# Altium schematic sheet Sheet1.SchDoc
size Letter
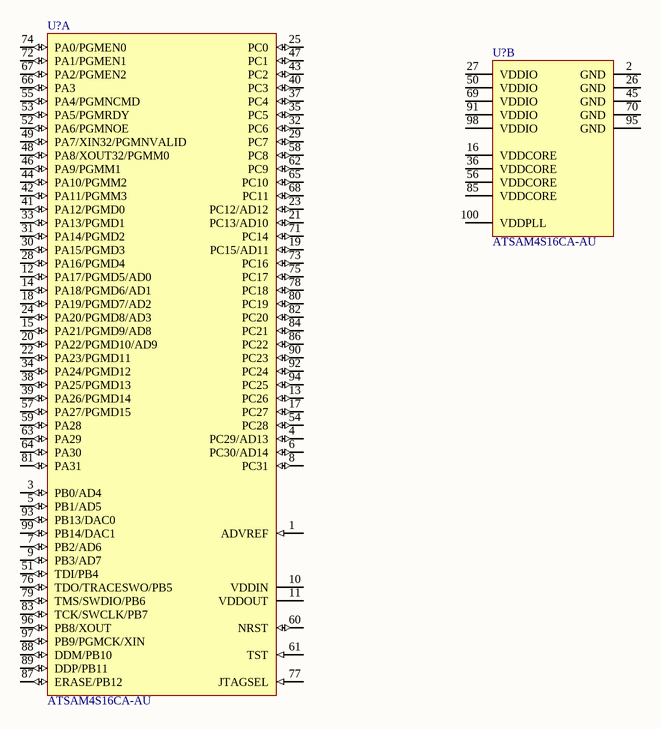
[diagram p0: Sheet1.SchDoc]

## Parts
(Parts that share a designator on the sheet are numbered #1, #2 ... from top to bottom, then left to right.)
U?#1  ATSAM4S16CA-AU  [LQFP100_N]  (part A of 2)
U?#2  ATSAM4S16CA-AU  [LQFP100_N]  (part B of 2)

## Nets

Not connected (* = marked no-connect by the designer): U?#1 1(ADVREF) 3(PB0/AD4) 4(PC29/AD13) 5(PB1/AD5) 6(PC30/AD14) 7(PB2/AD6) 8(PC31) 9(PB3/AD7) 10(VDDIN) 11(VDDOUT) 12(PA17/PGMD5/AD0) 13(PC26) 14(PA18/PGMD6/AD1) 15(PA21/PGMD9/AD8) 17(PC27) 18(PA19/PGMD7/AD2) 19(PC15/AD11) 20(PA22/PGMD10/AD9) 21(PC13/AD10) 22(PA23/PGMD11) 23(PC12/AD12) 24(PA20/PGMD8/AD3) 25(PC0) 28(PA16/PGMD4) 29(PC7) 30(PA15/PGMD3) 31(PA14/PGMD2) 32(PC6) 33(PA13/PGMD1) 34(PA24/PGMD12) 35(PC5) 37(PC4) 38(PA25/PGMD13) 39(PA26/PGMD14) 40(PC3) 41(PA12/PGMD0) 42(PA11/PGMM3) 43(PC2) 44(PA10/PGMM2) 46(PA9/PGMM1) 47(PC1) 48(PA8/XOUT32/PGMM0) 49(PA7/XIN32/PGMNVALID) 51(TDI/PB4) 52(PA6/PGMNOE) 53(PA5/PGMRDY) 54(PC28) 55(PA4/PGMNCMD) 57(PA27/PGMD15) 58(PC8) 59(PA28) 60(NRST) 61(TST) 62(PC9) 63(PA29) 64(PA30) 65(PC10) 66(PA3) 67(PA2/PGMEN2) 68(PC11) 71(PC14) 72(PA1/PGMEN1) 73(PC16) 74(PA0/PGMEN0) 75(PC17) 76(TDO/TRACESWO/PB5) 77(JTAGSEL) 78(PC18) 79(TMS/SWDIO/PB6) 80(PC19) 81(PA31) 82(PC20) 83(TCK/SWCLK/PB7) 84(PC21) 86(PC22) 87(ERASE/PB12) 88(DDM/PB10) 89(DDP/PB11) 90(PC23) 92(PC24) 93(PB13/DAC0) 94(PC25) 96(PB8/XOUT) 97(PB9/PGMCK/XIN) 99(PB14/DAC1); U?#2 2(GND) 16(VDDCORE) 26(GND) 27(VDDIO) 36(VDDCORE) 45(GND) 50(VDDIO) 56(VDDCORE) 69(VDDIO) 70(GND) 85(VDDCORE) 91(VDDIO) 95(GND) 98(VDDIO) 100(VDDPLL)

## Library data of the parts
U?#1 U?#2 = ATSAM4S16CA-AU: AT91 ARM Cortex-M4 32-bit Microcontroller, 1MB Flash, 128KB SRAM, USB, 79 User I/Os, 100-Pin LQFP, Industrial Grade (-40°C to 105°C), Pb-Free; DatasheetVersion: revA, Oct-2011; PackageVersion: Apr-2006; PackageReference: LQFP100; PackageDescription: 100-Pin Thin Quad Flat Pack 0.5 mm Pitch; Code_JEDEC: MS-026-BED; ComponentLink1Description: Manufacturer URL; ComponentLink1URL: http://www.atmel.com/; ComponentLink2Description: SAM4S Series Datasheet; ComponentLink2URL: http://www.atmel.com/dyn/resources/prod_documents/11100.pdf; ComponentLink3Description: SAM4S Series Summary; ComponentLink3URL: http://www.atmel.com/dyn/resources/prod_documents/11100S.pdf